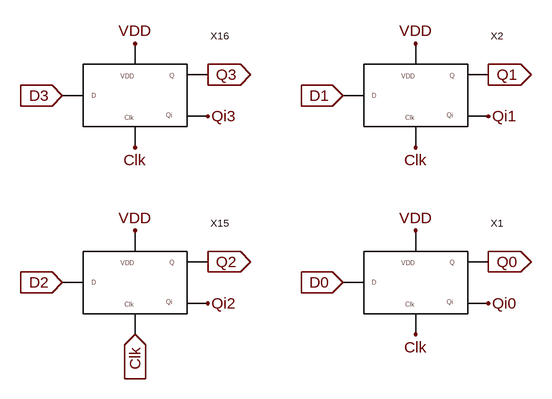
[diagram p0: schematic 4_bit_register.asc]
4_bit_register.asc, the LTspice schematic file:
Version 4
SHEET 1 880 932
FLAG -944 672 VDD
FLAG -944 832 Clk
IOPIN -944 832 In
FLAG -832 784 Qi2
FLAG -944 384 VDD
FLAG -944 544 Clk
FLAG -1056 464 D3
IOPIN -1056 464 In
FLAG -832 432 Q3
IOPIN -832 432 Out
FLAG -832 496 Qi3
FLAG -512 672 VDD
FLAG -512 832 Clk
FLAG -400 784 Qi0
FLAG -512 384 VDD
FLAG -512 544 Clk
FLAG -400 496 Qi1
FLAG -1056 752 D2
IOPIN -1056 752 In
FLAG -624 464 D1
IOPIN -624 464 In
FLAG -624 752 D0
IOPIN -624 752 In
FLAG -832 720 Q2
IOPIN -832 720 Out
FLAG -400 432 Q1
IOPIN -400 432 Out
FLAG -400 720 Q0
IOPIN -400 720 Out
SYMBOL DFF -1024 800 R0
SYMATTR InstName X15
SYMBOL DFF -1024 512 R0
SYMATTR InstName X16
SYMBOL DFF -592 800 R0
SYMATTR InstName X1
SYMBOL DFF -592 512 R0
SYMATTR InstName X2

The netlist it stands for:
* 4_bit_register.asc
XX15 D2 Clk Q2 Qi2 VDD DFF  ; pins D Clk Q Qi VDD
XX16 D3 Clk Q3 Qi3 VDD DFF  ; pins D Clk Q Qi VDD
XX1 D0 Clk Q0 Qi0 VDD DFF  ; pins D Clk Q Qi VDD
XX2 D1 Clk Q1 Qi1 VDD DFF  ; pins D Clk Q Qi VDD
.backanno
.end